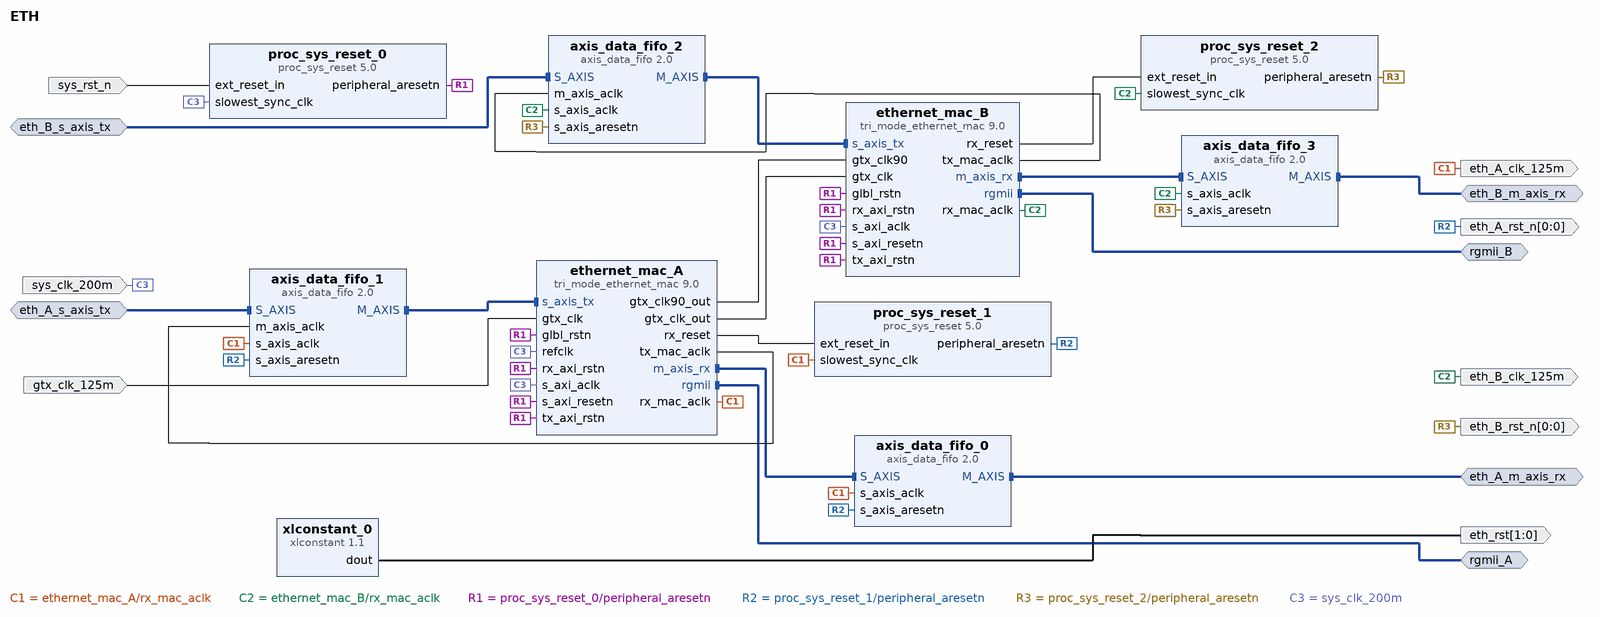
[diagram p0: block diagram of the top level]
# Vivado block design ETH, xc7k325tffg676-2, Vivado 2023.1
create_bd_design ETH

create_bd_intf_port -mode Master -vlnv xilinx.com:interface:rgmii_rtl:1.0 rgmii_A
create_bd_intf_port -mode Master -vlnv xilinx.com:interface:rgmii_rtl:1.0 rgmii_B
create_bd_intf_port -mode Master -vlnv xilinx.com:interface:axis_rtl:1.0 eth_A_m_axis_rx
create_bd_intf_port -mode Slave -vlnv xilinx.com:interface:axis_rtl:1.0 eth_A_s_axis_tx
set_property -dict [list \
  CONFIG.HAS_TKEEP 0 \
  CONFIG.HAS_TLAST 0 \
  CONFIG.HAS_TREADY 1 \
  CONFIG.HAS_TSTRB 0 \
  CONFIG.LAYERED_METADATA undef \
  CONFIG.TDATA_NUM_BYTES 1 \
  CONFIG.TDEST_WIDTH 0 \
  CONFIG.TID_WIDTH 0 \
  CONFIG.TUSER_WIDTH 0 \
] [get_bd_intf_ports eth_A_s_axis_tx]
create_bd_intf_port -mode Master -vlnv xilinx.com:interface:axis_rtl:1.0 eth_B_m_axis_rx
create_bd_intf_port -mode Slave -vlnv xilinx.com:interface:axis_rtl:1.0 eth_B_s_axis_tx
set_property -dict [list \
  CONFIG.HAS_TKEEP 0 \
  CONFIG.HAS_TLAST 0 \
  CONFIG.HAS_TREADY 1 \
  CONFIG.HAS_TSTRB 0 \
  CONFIG.LAYERED_METADATA undef \
  CONFIG.TDATA_NUM_BYTES 1 \
  CONFIG.TDEST_WIDTH 0 \
  CONFIG.TID_WIDTH 0 \
  CONFIG.TUSER_WIDTH 0 \
] [get_bd_intf_ports eth_B_s_axis_tx]
create_bd_port -dir I -type clk sys_clk_200m
set_property -dict {CONFIG.ASSOCIATED_RESET sys_rst_n CONFIG.FREQ_HZ 200000000} [get_bd_ports sys_clk_200m]
create_bd_port -dir I -type clk gtx_clk_125m
set_property -dict {CONFIG.FREQ_HZ 125000000} [get_bd_ports gtx_clk_125m]
create_bd_port -dir O -type clk eth_A_clk_125m
set_property -dict [list \
  CONFIG.ASSOCIATED_BUSIF eth_A_s_axis_tx:eth_A_m_axis_rx \
  CONFIG.ASSOCIATED_RESET eth_A_rst_n \
] [get_bd_ports eth_A_clk_125m]
create_bd_port -dir O -type clk eth_B_clk_125m
set_property -dict [list \
  CONFIG.ASSOCIATED_BUSIF eth_B_s_axis_tx:eth_B_m_axis_rx \
  CONFIG.ASSOCIATED_RESET eth_B_rst_n \
] [get_bd_ports eth_B_clk_125m]
create_bd_port -dir O -from 0 -to 0 -type rst eth_A_rst_n
create_bd_port -dir O -from 0 -to 0 -type rst eth_B_rst_n
create_bd_port -dir I -type rst sys_rst_n
create_bd_port -dir O -from 1 -to 0 eth_rst

create_bd_cell -type ip -vlnv xilinx.com:ip:tri_mode_ethernet_mac:9.0 ethernet_mac_A
set_property -dict [list \
  CONFIG.Enable_MDIO false \
  CONFIG.Frame_Filter false \
  CONFIG.MAC_Speed 1000_Mbps \
  CONFIG.Management_Frequency 200 \
  CONFIG.Management_Interface true \
  CONFIG.Physical_Interface RGMII \
  CONFIG.Statistics_Counters false \
  CONFIG.SupportLevel 1 \
] [get_bd_cells ethernet_mac_A]
create_bd_cell -type ip -vlnv xilinx.com:ip:tri_mode_ethernet_mac:9.0 ethernet_mac_B
set_property -dict [list \
  CONFIG.Enable_MDIO false \
  CONFIG.Frame_Filter false \
  CONFIG.MAC_Speed 1000_Mbps \
  CONFIG.Management_Frequency 200 \
  CONFIG.Physical_Interface RGMII \
  CONFIG.Statistics_Counters false \
  CONFIG.SupportLevel 0 \
] [get_bd_cells ethernet_mac_B]
create_bd_cell -type ip -vlnv xilinx.com:ip:proc_sys_reset:5.0 proc_sys_reset_0
create_bd_cell -type ip -vlnv xilinx.com:ip:axis_data_fifo:2.0 axis_data_fifo_0
create_bd_cell -type ip -vlnv xilinx.com:ip:axis_data_fifo:2.0 axis_data_fifo_1
set_property -dict {CONFIG.IS_ACLK_ASYNC 1} [get_bd_cells axis_data_fifo_1]
create_bd_cell -type ip -vlnv xilinx.com:ip:axis_data_fifo:2.0 axis_data_fifo_2
set_property -dict {CONFIG.IS_ACLK_ASYNC 1} [get_bd_cells axis_data_fifo_2]
create_bd_cell -type ip -vlnv xilinx.com:ip:axis_data_fifo:2.0 axis_data_fifo_3
create_bd_cell -type ip -vlnv xilinx.com:ip:proc_sys_reset:5.0 proc_sys_reset_1
create_bd_cell -type ip -vlnv xilinx.com:ip:proc_sys_reset:5.0 proc_sys_reset_2
create_bd_cell -type ip -vlnv xilinx.com:ip:xlconstant:1.1 xlconstant_0
set_property -dict {CONFIG.CONST_VAL 3 CONFIG.CONST_WIDTH 2} [get_bd_cells xlconstant_0]

# ---- connections ----

connect_bd_intf_net -intf_net S_AXIS_0_1 [get_bd_intf_ports eth_B_s_axis_tx] [get_bd_intf_pins axis_data_fifo_2/S_AXIS]
connect_bd_intf_net [get_bd_intf_ports eth_A_m_axis_rx] [get_bd_intf_pins axis_data_fifo_0/M_AXIS]
connect_bd_intf_net [get_bd_intf_pins axis_data_fifo_1/M_AXIS] [get_bd_intf_pins ethernet_mac_A/s_axis_tx]
connect_bd_intf_net [get_bd_intf_pins axis_data_fifo_2/M_AXIS] [get_bd_intf_pins ethernet_mac_B/s_axis_tx]
connect_bd_intf_net [get_bd_intf_ports eth_B_m_axis_rx] [get_bd_intf_pins axis_data_fifo_3/M_AXIS]
connect_bd_intf_net [get_bd_intf_ports eth_A_s_axis_tx] [get_bd_intf_pins axis_data_fifo_1/S_AXIS]
connect_bd_intf_net [get_bd_intf_pins axis_data_fifo_0/S_AXIS] [get_bd_intf_pins ethernet_mac_A/m_axis_rx]
connect_bd_intf_net [get_bd_intf_pins ethernet_mac_B/m_axis_rx] [get_bd_intf_pins axis_data_fifo_3/S_AXIS]
connect_bd_intf_net [get_bd_intf_ports rgmii_B] [get_bd_intf_pins ethernet_mac_B/rgmii]
connect_bd_intf_net -intf_net tri_mode_ethernet_mac_0_rgmii [get_bd_intf_ports rgmii_A] [get_bd_intf_pins ethernet_mac_A/rgmii]
connect_bd_net [get_bd_pins ethernet_mac_A/gtx_clk90_out] [get_bd_pins ethernet_mac_B/gtx_clk90]
connect_bd_net [get_bd_pins ethernet_mac_A/gtx_clk_out] [get_bd_pins ethernet_mac_B/gtx_clk]
connect_bd_net [get_bd_pins ethernet_mac_A/rx_mac_aclk] \
  [get_bd_pins axis_data_fifo_0/s_axis_aclk] [get_bd_pins axis_data_fifo_1/s_axis_aclk] [get_bd_ports eth_A_clk_125m] \
  [get_bd_pins proc_sys_reset_1/slowest_sync_clk]
connect_bd_net [get_bd_pins ethernet_mac_A/rx_reset] [get_bd_pins proc_sys_reset_1/ext_reset_in]
connect_bd_net [get_bd_pins ethernet_mac_A/tx_mac_aclk] [get_bd_pins axis_data_fifo_1/m_axis_aclk]
connect_bd_net [get_bd_pins ethernet_mac_B/rx_mac_aclk] \
  [get_bd_ports eth_B_clk_125m] [get_bd_pins axis_data_fifo_3/s_axis_aclk] [get_bd_pins axis_data_fifo_2/s_axis_aclk] \
  [get_bd_pins proc_sys_reset_2/slowest_sync_clk]
connect_bd_net [get_bd_pins ethernet_mac_B/rx_reset] [get_bd_pins proc_sys_reset_2/ext_reset_in]
connect_bd_net [get_bd_pins ethernet_mac_B/tx_mac_aclk] [get_bd_pins axis_data_fifo_2/m_axis_aclk]
connect_bd_net [get_bd_ports gtx_clk_125m] [get_bd_pins ethernet_mac_A/gtx_clk]
connect_bd_net [get_bd_pins proc_sys_reset_0/peripheral_aresetn] \
  [get_bd_pins ethernet_mac_B/s_axi_resetn] [get_bd_pins ethernet_mac_A/s_axi_resetn] [get_bd_pins ethernet_mac_A/glbl_rstn] \
  [get_bd_pins ethernet_mac_A/rx_axi_rstn] [get_bd_pins ethernet_mac_A/tx_axi_rstn] [get_bd_pins ethernet_mac_B/glbl_rstn] \
  [get_bd_pins ethernet_mac_B/rx_axi_rstn] [get_bd_pins ethernet_mac_B/tx_axi_rstn]
connect_bd_net [get_bd_pins proc_sys_reset_1/peripheral_aresetn] \
  [get_bd_pins axis_data_fifo_0/s_axis_aresetn] [get_bd_pins axis_data_fifo_1/s_axis_aresetn] [get_bd_ports eth_A_rst_n]
connect_bd_net [get_bd_pins proc_sys_reset_2/peripheral_aresetn] \
  [get_bd_pins axis_data_fifo_3/s_axis_aresetn] [get_bd_pins axis_data_fifo_2/s_axis_aresetn] [get_bd_ports eth_B_rst_n]
connect_bd_net -net sys_clk_50m_1 [get_bd_ports sys_clk_200m] \
  [get_bd_pins ethernet_mac_A/s_axi_aclk] [get_bd_pins ethernet_mac_B/s_axi_aclk] \
  [get_bd_pins proc_sys_reset_0/slowest_sync_clk] [get_bd_pins ethernet_mac_A/refclk]
connect_bd_net [get_bd_ports sys_rst_n] [get_bd_pins proc_sys_reset_0/ext_reset_in]
connect_bd_net [get_bd_pins xlconstant_0/dout] [get_bd_ports eth_rst]

validate_bd_design
save_bd_design
